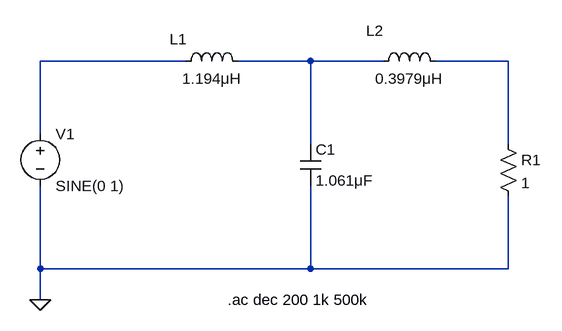
[diagram p0: schematic (3)butterworth.asc]
(3)butterworth.asc, the LTspice schematic file:
Version 4
SHEET 1 1188 680
WIRE 640 16 416 16
WIRE 832 16 720 16
WIRE 944 16 832 16
WIRE 1136 16 1024 16
WIRE 416 128 416 16
WIRE 832 144 832 16
WIRE 1136 144 1136 16
WIRE 416 336 416 208
WIRE 832 336 832 208
WIRE 832 336 416 336
WIRE 1136 336 1136 224
WIRE 1136 336 832 336
WIRE 416 384 416 336
FLAG 416 384 0
SYMBOL voltage 416 112 R0
SYMATTR InstName V1
SYMATTR Value SINE(0 1)
SYMATTR Value2 AC 1
SYMBOL ind 624 32 R270
WINDOW 0 34 5 VTop 2
WINDOW 3 5 56 VBottom 2
SYMATTR InstName L1
SYMATTR Value 1.194μH
SYMBOL ind 928 32 R270
WINDOW 0 47 3 VTop 2
WINDOW 3 5 56 VBottom 2
SYMATTR InstName L2
SYMATTR Value 0.3979μH
SYMBOL cap 816 144 R0
SYMATTR InstName C1
SYMATTR Value 1.061μF
SYMBOL res 1120 128 R0
SYMATTR InstName R1
SYMATTR Value 1
TEXT 704 384 Left 2 !.ac dec 200 1k 500k

The netlist it stands for:
* (3)butterworth.asc
V1 N001 0 SINE(0 1) AC 1
L1 N001 N002 1.194μH
L2 N002 N003 0.3979μH
C1 N002 0 1.061μF
R1 N003 0 1
.ac dec 200 1k 500k
.backanno
.end

* Results of the author's LTspice run, read from the files saved beside the schematic
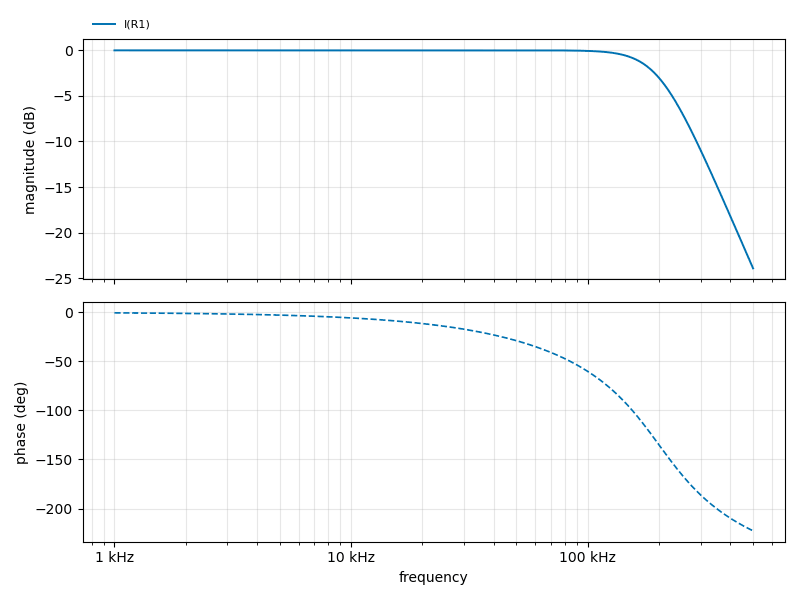
[diagram p1: AC Analysis of (3)butterworth.asc, plotted from the saved traces]
* AC Analysis, 1 run:
*   I(R1): -0.02 dB at 1 kHz, -23.90 dB at 500 kHz, peak -0.02 dB at 43.15 kHz, 3 dB below the peak at 200.1 kHz